# Altium schematic sheet A4988.SchDoc: Title
size A4; Date: *******; ApprovedBy: *******; CheckedBy: None; Author: *******; CompanyName: *******; DrawnBy: Name; Engineer: *******; Organization: *******; Address1: *******; Address2: *******; Address3: *******; Address4: *******; DocumentNumber: 4; Revision: *******; SheetNumber: 4; SheetTotal: 11; CurrentTime: *******; CurrentDate: *******; Time: *******; DocumentFullPathAndName: *******; DocumentName: *******; ModifiedDate: *******; ImagePath: *******; ProjectName: *******; Application_BuildNumber: *******
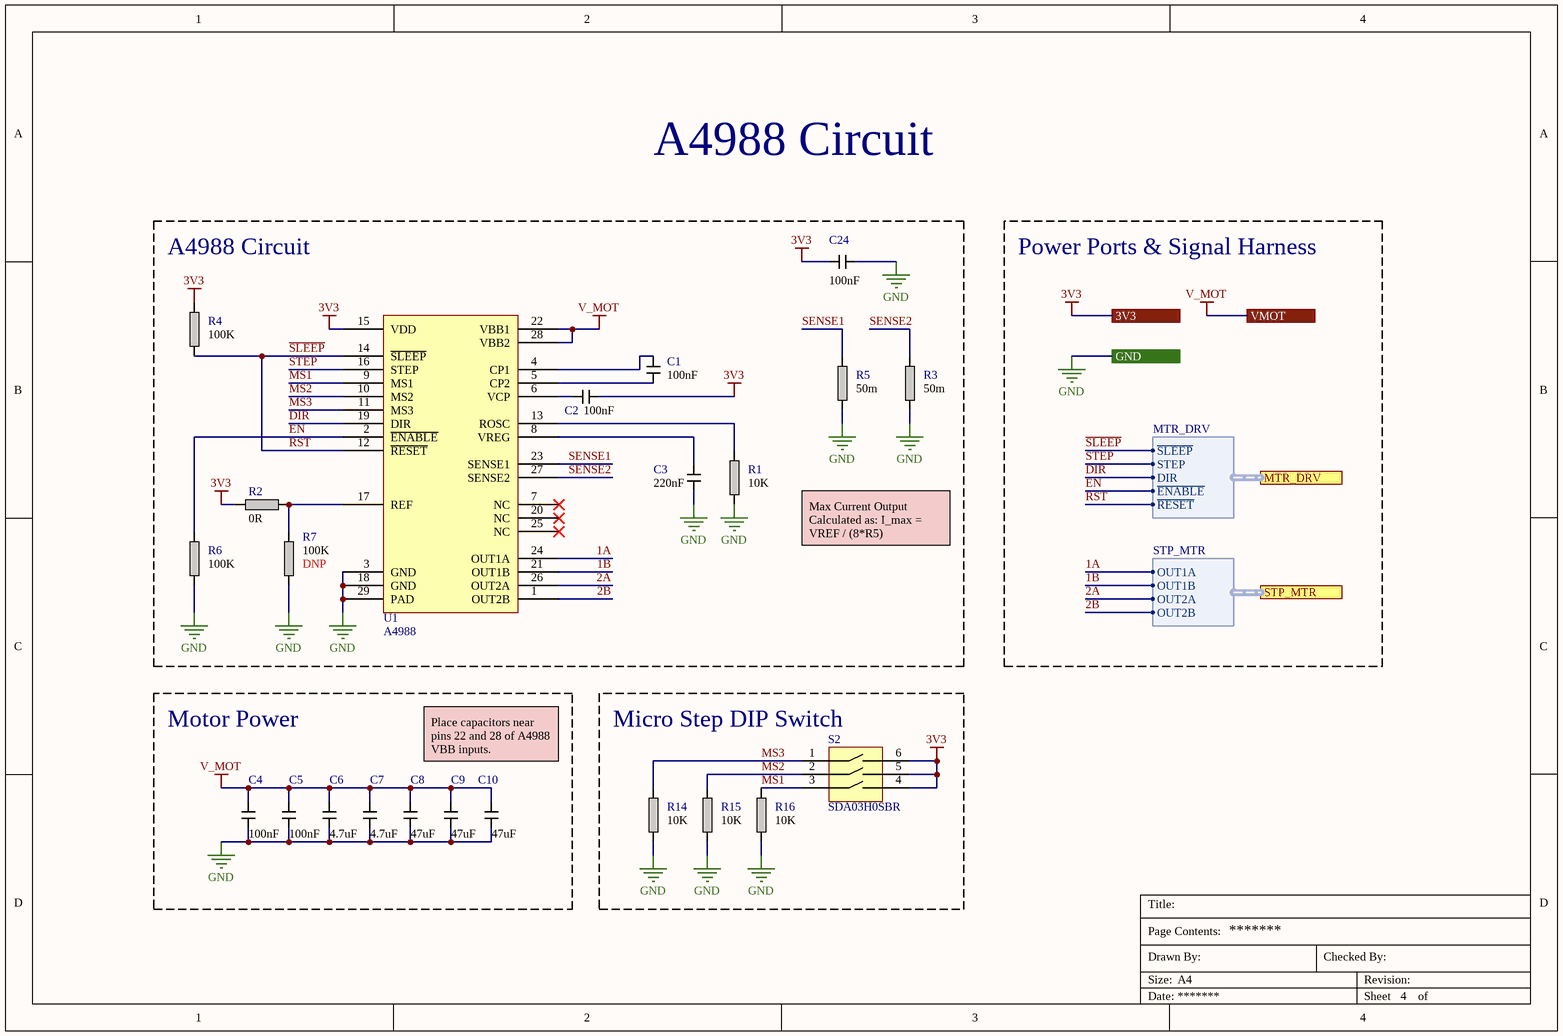
[diagram p0: A4988.SchDoc]

## Parts
C1  value 100nF  [0805]  (hidden comment: CAP)
C2  value 100nF  [0805]  (hidden comment: CAP)
C3  value 220nF  [0805]  (hidden comment: CAP)
C4  value 100nF  [0805]  (hidden comment: CAP)
C5  value 100nF  [0805]  (hidden comment: CAP)
C6  value 4.7uF  [0805]  (hidden comment: CAP)
C7  value 4.7uF  [0805]  (hidden comment: CAP)
C8  value 47uF  [1206]  (hidden comment: CAP)
C9  value 47uF  [1206]  (hidden comment: CAP)
C10  value 47uF  [1206]  (hidden comment: CAP)
C24  value 100nF  [0805]  (hidden comment: CAP)
R1  value 10K  [0805]  (hidden comment: RES)
R2  value 0R  [0805]  (hidden comment: RES)
R3  value 50m  [0805]  (hidden comment: RES)
R4  value 100K  [0805]  (hidden comment: RES)
R5  value 50m  [0805]  (hidden comment: RES)
R6  value 100K  [0805]  (hidden comment: RES)
R7  value 100K  Comments: DNP  [0805]  (hidden comment: RES)
R14  value 10K  [0805]  (hidden comment: RES)
R15  value 10K  [0805]  (hidden comment: RES)
R16  value 10K  [0805]  (hidden comment: RES)
S2  DIP SWITCH 3POS  [SDA03H0SBR]  (value not drawn)
U1  A4988  [28-QFN]

## Blocks framed on the sheet
A4988 Circuit: C1-C3 C24 R1-R7 U1
Motor Power: C4-C10
Micro Step DIP Switch: R14-R16 S2

## Ports
3V3 (see Stepper_Driver[2C], ESP32_Block[3C], ESP32_Module[3B], GPIO_Header[3B], I2C_Header[3B], Power[3B], SPI_Header[3B], Stepper_Driver[3A]), GND (see Stepper_Driver[2C], ESP32_Block[3D], ESP32_Module[3B], GPIO_Header[3B], I2C_Header[3B], Mechanical_Holes[3B], Power[3C], SPI_Header[3B], Stepper_Driver[3B], USB_Connector[3B]), MTR_DRV (harness MTR_DRV, see Stepper_Driver[2C]), STP_MTR (harness STP_MTR, see Stepper_Driver[2C]), VMOT (see Stepper_Driver[2C])

## Harnesses
MTR_DRV: ~{SLEEP}, STEP, DIR, ~{ENABLE}, ~{RESET}
STP_MTR: OUT1A, OUT1B, OUT2A, OUT2B

## Nets
3V3: C2.1 C24.1 R2.2 R4.1 S2.4 S2.5 S2.6 U1.15(VDD) ; port 3V3
GND: C3.1 C4.1 C5.1 C6.2 C7.2 C8.2 C9.2 C10.2 C24.2 R1.1 R3.1 R5.1 R6.2 R7.2 R14.1 R15.1 R16.1 U1.3(GND) U1.18(GND) U1.29(PAD) ; port GND
V_MOT: C4.2 C5.2 C6.1 C7.1 C8.1 C9.1 C10.1 U1.22(VBB1) U1.28(VBB2) ; port VMOT
1A: U1.24(OUT1A) ; port STP_MTR.OUT1A
1B: U1.21(OUT1B) ; port STP_MTR.OUT1B
2A: U1.26(OUT2A) ; port STP_MTR.OUT2A
2B: U1.1(OUT2B) ; port STP_MTR.OUT2B
DIR: U1.19(DIR) ; port MTR_DRV.DIR
~{EN}: R6.1 U1.2(~{ENABLE}) ; port MTR_DRV.~{ENABLE}
MS1: R16.2 S2.3 U1.9(MS1)
MS2: R15.2 S2.2 U1.10(MS2)
MS3: R14.2 S2.1 U1.11(MS3)
~{RST}: R4.2 U1.12(~{RESET}) U1.14(~{SLEEP}) ; port MTR_DRV.~{SLEEP}, port MTR_DRV.~{RESET}  [also labelled ~{SLEEP}]
SENSE1: R5.2 U1.23(SENSE1)
SENSE2: R3.2 U1.27(SENSE2)
STEP: U1.16(STEP) ; port MTR_DRV.STEP
NetC1_1: C1.1 U1.5(CP2)
NetC1_2: C1.2 U1.4(CP1)
NetC2_2: C2.2 U1.6(VCP)
NetC3_2: C3.2 U1.8(VREG)
NetR1_2: R1.2 U1.13(ROSC)
NetR2_1: R2.1 R7.1 U1.17(REF)

Not connected (* = marked no-connect by the designer): U1 7(NC)* 20(NC)* 25(NC)*

## Notes on the sheet
- A4988 Circuit
- Power Ports & Signal Harness
- Max Current Output Calculated as: I_max = VREF / (8*R5)
- Place capacitors near pins 22 and 28 of A4988 VBB inputs.
- Title:
- Size:
- Date:
- Drawn By:
- Page Contents:
- A4
- Checked By:
- Revision:
- Sheet
- of

## Library data of the parts
C1 C2 C4 C5 C24 = CAP: 50V 100nF X7R ±10% 0805  Multilayer Ceramic Capacitors MLCC - SMD/SMT ROHS; Manufacturer: YAGEO; Manufacturer Part Number: CC0805KRX7R9BB104; Supplier: JLCPCB; Supplier Part Number: C49678
C3 = CAP: 50V 220nF X7R ±10% 0805  Multilayer Ceramic Capacitors MLCC - SMD/SMT ROHS; Manufacturer: Samsung Electro-Mechanics; Manufacturer Part Number: CL21B224KBFNNNE; Supplier: JLCPCB; Supplier Part Number: C5378
C6 C7 = CAP: 35V 4.7uF X7R ±10% 0805  Multilayer Ceramic Capacitors MLCC - SMD/SMT ROHS; Manufacturer: Samwha Capacitor; Manufacturer Part Number: CS2012X7R475K350NRE; Supplier: JLCPCB; Supplier Part Number: C560882
C8-C10 = CAP: 25V 47uF X5R ±20% 1206  Multilayer Ceramic Capacitors MLCC - SMD/SMT ROHS; Manufacturer: TDK; Manufacturer Part Number: C3216X5R1E476MTJ00E; Supplier: JLCPCB; Supplier Part Number: C76659
R1 R14-R16 = RES: 125mW Thick Film Resistors ±1% 10kΩ 0805  Chip Resistor - Surface Mount ROHS; Manufacturer: UNI-ROYAL(Uniroyal Elec); Manufacturer Part Number: 0805W8F1002T5E; Supplier: JLCPCB; Supplier Part Number: C17414
R2 = RES: 125mW 0Ω 0805 Chip Resistor - Surface Mount ROHS; Manufacturer: PANASONIC; Manufacturer Part Number: ERJ6GEY0R00V; Supplier: JLCPCB; Supplier Part Number: C169855
R3 R5 = RES: 250mW ±1% 50mΩ 0805  Chip Resistor - Surface Mount ROHS; Manufacturer: YAGEO; Manufacturer Part Number: PE0805FRF7W0R05L; Supplier: JLCPCB; Supplier Part Number: C858613
R4 R6 R7 = RES: 125mW ±5% 100kΩ 0805  Chip Resistor - Surface Mount ROHS; Manufacturer: FH (Guangdong Fenghua Advanced Tech); Manufacturer Part Number: RS-05K104JT; Supplier: JLCPCB; Supplier Part Number: C118844
S2 = DIP SWITCH 3POS: SWITCH SLIDE DIP SPST 25MA 24V; Manufacturer: C&K; Supplier: JLCPCB; Supplier Part Number: C221950; Manufacturer Part Number: SDA03H0SBR
U1 = A4988: IC MTR DRVR BIPOLAR 3-5.5V 28QFN; Manufacturer: Allegro MicroSystems, LLC; Manufacturer Part Number: A4988SETTR-T; Supplier: JLCPCB; Supplier Part Number: C38437